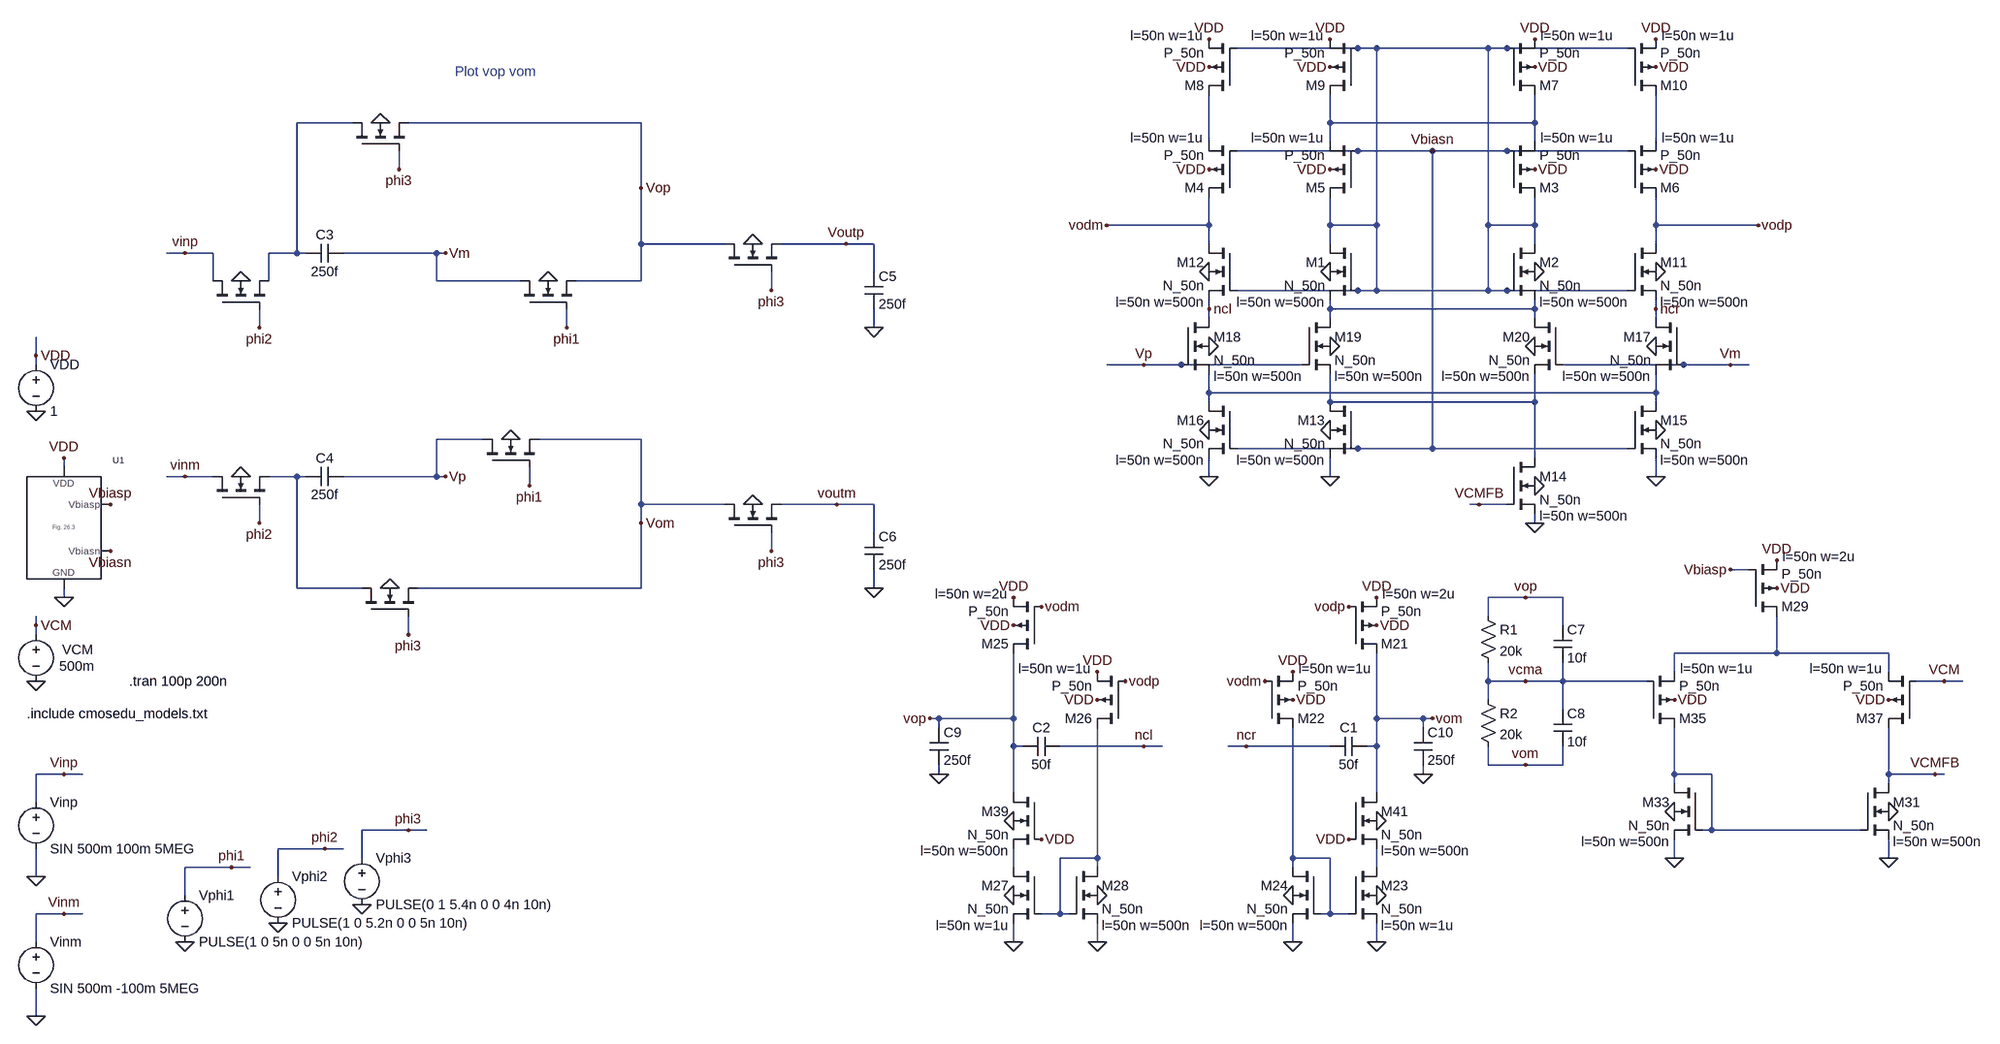
[diagram p0: schematic Fig26_36.asc]
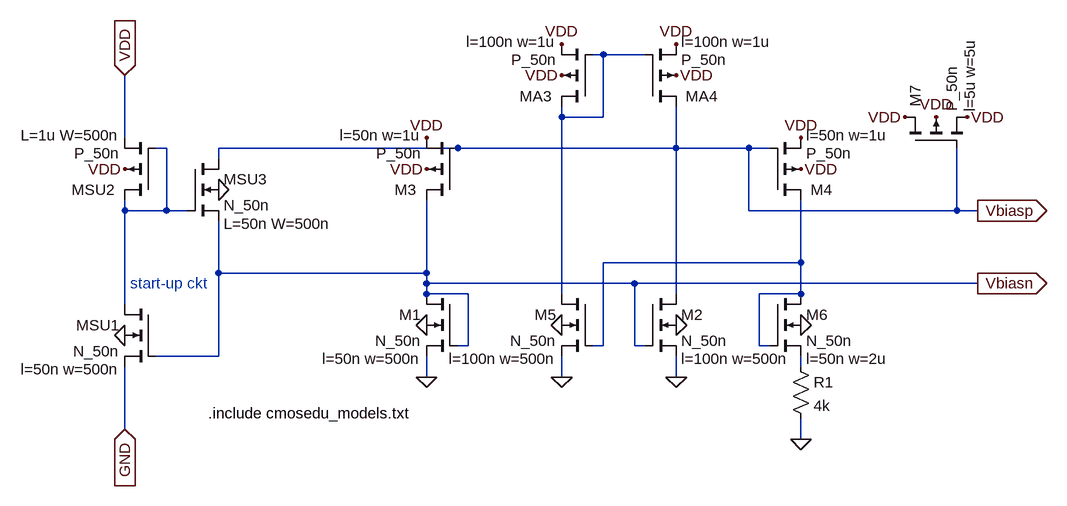
[diagram p1: sub-circuit fig_26_3.asc]
Fig26_36.asc, the LTspice schematic file:
Version 4
SHEET 1 4388 992
WIRE 3024 -896 2816 -896
WIRE 3056 -896 3024 -896
WIRE 3248 -896 3056 -896
WIRE 3280 -896 3248 -896
WIRE 3488 -896 3280 -896
WIRE 1296 -768 1200 -768
WIRE 1792 -768 1392 -768
WIRE 2976 -768 2976 -816
WIRE 3328 -768 3328 -816
WIRE 3328 -768 2976 -768
WIRE 2768 -736 2768 -816
WIRE 2976 -736 2976 -768
WIRE 3328 -736 3328 -768
WIRE 3536 -736 3536 -816
WIRE 3024 -720 2816 -720
WIRE 3152 -720 3024 -720
WIRE 3280 -720 3152 -720
WIRE 3488 -720 3280 -720
WIRE 1376 -688 1376 -720
WIRE 1792 -656 1792 -768
WIRE 2768 -592 2768 -640
WIRE 2768 -592 2592 -592
WIRE 2976 -592 2976 -640
WIRE 3056 -592 3056 -896
WIRE 3056 -592 2976 -592
WIRE 3248 -592 3248 -896
WIRE 3328 -592 3328 -640
WIRE 3328 -592 3248 -592
WIRE 3536 -592 3536 -640
WIRE 3712 -592 3536 -592
WIRE 1792 -560 1792 -656
WIRE 1936 -560 1792 -560
WIRE 2144 -560 2032 -560
WIRE 2192 -560 2144 -560
WIRE 2768 -560 2768 -592
WIRE 2976 -560 2976 -592
WIRE 3328 -560 3328 -592
WIRE 3536 -560 3536 -592
WIRE 1008 -544 976 -544
WIRE 1056 -544 1008 -544
WIRE 1200 -544 1200 -768
WIRE 1200 -544 1152 -544
WIRE 1216 -544 1200 -544
WIRE 1440 -544 1280 -544
WIRE 1456 -544 1440 -544
WIRE 2192 -512 2192 -560
WIRE 1056 -496 1056 -544
WIRE 1152 -496 1152 -544
WIRE 1440 -496 1440 -544
WIRE 1584 -496 1440 -496
WIRE 1792 -496 1792 -560
WIRE 1792 -496 1680 -496
WIRE 2016 -480 2016 -512
WIRE 3024 -480 2816 -480
WIRE 3056 -480 3056 -592
WIRE 3056 -480 3024 -480
WIRE 3248 -480 3248 -592
WIRE 3248 -480 3056 -480
WIRE 3280 -480 3248 -480
WIRE 3488 -480 3280 -480
WIRE 2768 -448 2768 -464
WIRE 2976 -448 2976 -464
WIRE 3328 -448 3328 -464
WIRE 3328 -448 2976 -448
WIRE 3536 -448 3536 -464
WIRE 2768 -432 2768 -448
WIRE 2976 -432 2976 -448
WIRE 3328 -432 3328 -448
WIRE 3536 -432 3536 -448
WIRE 1136 -416 1136 -448
WIRE 1664 -416 1664 -448
WIRE 2192 -416 2192 -448
WIRE 752 -368 752 -400
WIRE 752 -352 752 -368
WIRE 2656 -352 2592 -352
WIRE 2720 -352 2656 -352
WIRE 2928 -352 2720 -352
WIRE 3584 -352 3376 -352
WIRE 3664 -352 3584 -352
WIRE 3696 -352 3664 -352
WIRE 2768 -304 2768 -336
WIRE 3536 -304 3536 -336
WIRE 3536 -304 2768 -304
WIRE 2768 -288 2768 -304
WIRE 2976 -288 2976 -336
WIRE 3328 -288 3328 -336
WIRE 3328 -288 2976 -288
WIRE 3536 -288 3536 -304
WIRE 1520 -224 1440 -224
WIRE 1792 -224 1616 -224
WIRE 3024 -208 2816 -208
WIRE 3152 -208 3152 -720
WIRE 3152 -208 3024 -208
WIRE 3488 -208 3152 -208
WIRE 3328 -192 3328 -288
WIRE 800 -176 800 -192
WIRE 1008 -160 976 -160
WIRE 1056 -160 1008 -160
WIRE 1200 -160 1152 -160
WIRE 1216 -160 1200 -160
WIRE 1440 -160 1440 -224
WIRE 1440 -160 1280 -160
WIRE 1456 -160 1440 -160
WIRE 2768 -160 2768 -192
WIRE 2976 -160 2976 -192
WIRE 3536 -160 3536 -192
WIRE 1600 -144 1600 -176
WIRE 1792 -112 1792 -224
WIRE 1936 -112 1792 -112
WIRE 2128 -112 2032 -112
WIRE 2192 -112 2128 -112
WIRE 3232 -112 3216 -112
WIRE 3280 -112 3232 -112
WIRE 1136 -80 1136 -112
WIRE 1792 -80 1792 -112
WIRE 3328 -80 3328 -96
WIRE 2192 -64 2192 -112
WIRE 2016 -32 2016 -64
WIRE 3696 0 3664 0
WIRE 1200 32 1200 -160
WIRE 1312 32 1200 32
WIRE 1792 32 1792 -80
WIRE 1792 32 1408 32
WIRE 2192 32 2192 0
WIRE 800 48 800 32
WIRE 3312 48 3248 48
WIRE 3376 48 3312 48
WIRE 3248 80 3248 48
WIRE 752 96 752 80
WIRE 3376 96 3376 48
WIRE 752 112 752 96
WIRE 1392 112 1392 80
WIRE 3744 144 3744 80
WIRE 3744 144 3568 144
WIRE 3936 144 3744 144
WIRE 3568 176 3568 144
WIRE 3936 176 3936 144
WIRE 3248 192 3248 160
WIRE 3312 192 3248 192
WIRE 3376 192 3376 160
WIRE 3376 192 3312 192
WIRE 3520 192 3376 192
WIRE 4032 192 3984 192
WIRE 4064 192 4032 192
WIRE 3248 224 3248 192
WIRE 3376 240 3376 192
WIRE 2304 256 2288 256
WIRE 2432 256 2432 144
WIRE 2432 256 2304 256
WIRE 3056 256 3056 144
WIRE 3136 256 3056 256
WIRE 3152 256 3136 256
WIRE 2304 272 2304 256
WIRE 3136 272 3136 256
WIRE 2432 304 2432 256
WIRE 2448 304 2432 304
WIRE 2656 304 2512 304
WIRE 2688 304 2656 304
WIRE 2832 304 2800 304
WIRE 2976 304 2832 304
WIRE 3056 304 3056 256
WIRE 3056 304 3040 304
WIRE 3248 336 3248 304
WIRE 3312 336 3248 336
WIRE 3376 336 3376 304
WIRE 3376 336 3312 336
WIRE 800 352 752 352
WIRE 832 352 800 352
WIRE 2304 352 2304 336
WIRE 3136 352 3136 336
WIRE 3568 352 3568 272
WIRE 3632 352 3568 352
WIRE 3936 352 3936 272
WIRE 4016 352 3936 352
WIRE 4032 352 4016 352
WIRE 3568 368 3568 352
WIRE 3936 368 3936 352
WIRE 2432 384 2432 304
WIRE 3056 384 3056 304
WIRE 752 400 752 352
WIRE 1392 448 1312 448
WIRE 1424 448 1392 448
WIRE 3632 448 3632 352
WIRE 3632 448 3616 448
WIRE 3888 448 3632 448
WIRE 1248 480 1168 480
WIRE 1280 480 1248 480
WIRE 1312 496 1312 448
WIRE 2576 496 2576 272
WIRE 2576 496 2512 496
WIRE 2912 496 2912 272
WIRE 2976 496 2912 496
WIRE 3568 496 3568 464
WIRE 3936 496 3936 464
WIRE 1088 512 1008 512
WIRE 1120 512 1088 512
WIRE 2432 512 2432 480
WIRE 2576 512 2576 496
WIRE 2912 512 2912 496
WIRE 3056 512 3056 480
WIRE 752 528 752 480
WIRE 1168 528 1168 480
WIRE 1008 560 1008 512
WIRE 800 592 752 592
WIRE 832 592 800 592
WIRE 2512 592 2512 496
WIRE 2512 592 2480 592
WIRE 2528 592 2512 592
WIRE 2976 592 2976 496
WIRE 2976 592 2960 592
WIRE 3008 592 2976 592
WIRE 752 640 752 592
WIRE 2432 640 2432 608
WIRE 2576 640 2576 608
WIRE 2912 640 2912 608
WIRE 3056 640 3056 608
WIRE 752 768 752 720
FLAG 752 -272 0
FLAG 752 -368 VDD
FLAG 800 -192 VDD
FLAG 800 48 0
FLAG 752 192 0
FLAG 880 -32 Vbiasn
FLAG 880 -112 Vbiasp
FLAG 752 96 VCM
FLAG 752 528 0
FLAG 800 352 Vinp
FLAG 752 768 0
FLAG 800 592 Vinm
FLAG 1104 -496 0
FLAG 1136 -416 phi2
FLAG 1008 -544 vinp
FLAG 1104 -160 0
FLAG 1136 -80 phi2
FLAG 1008 -160 vinm
FLAG 1456 -544 Vm
FLAG 1456 -160 Vp
FLAG 1344 -768 0
FLAG 1376 -688 phi3
FLAG 1360 32 0
FLAG 1392 112 phi3
FLAG 1632 -496 0
FLAG 1664 -416 phi1
FLAG 1568 -224 0
FLAG 1600 -144 phi1
FLAG 1792 -656 Vop
FLAG 1792 -80 Vom
FLAG 1984 -560 0
FLAG 2016 -480 phi3
FLAG 1984 -112 0
FLAG 2016 -32 phi3
FLAG 2192 -416 0
FLAG 2192 32 0
FLAG 2144 -560 Voutp
FLAG 2128 -112 voutm
FLAG 1008 640 0
FLAG 1088 512 phi1
FLAG 1168 608 0
FLAG 1248 480 phi2
FLAG 1312 576 0
FLAG 1392 448 phi3
FLAG 2976 -512 0
FLAG 3328 -512 0
FLAG 3328 -688 VDD
FLAG 2768 -688 VDD
FLAG 2976 -688 VDD
FLAG 3536 -688 VDD
FLAG 3328 -912 VDD
FLAG 3328 -864 VDD
FLAG 2768 -864 VDD
FLAG 2768 -912 VDD
FLAG 2976 -864 VDD
FLAG 2976 -912 VDD
FLAG 3536 -912 VDD
FLAG 3536 -864 VDD
FLAG 3536 -512 0
FLAG 2768 -512 0
FLAG 2976 -240 0
FLAG 3328 -144 0
FLAG 3536 -240 0
FLAG 2768 -240 0
FLAG 3536 -384 0
FLAG 2768 -384 0
FLAG 2976 -384 0
FLAG 3328 -384 0
FLAG 2768 -160 0
FLAG 3152 -720 Vbiasn
FLAG 3712 -592 vodp
FLAG 2592 -592 vodm
FLAG 2656 -352 Vp
FLAG 3664 -352 Vm
FLAG 3536 -448 ncr
FLAG 2768 -448 ncl
FLAG 3056 48 VDD
FLAG 3056 96 VDD
FLAG 2912 176 VDD
FLAG 2912 224 VDD
FLAG 3056 560 0
FLAG 3056 640 0
FLAG 2912 560 0
FLAG 2912 640 0
FLAG 2832 304 ncr
FLAG 3008 64 vodp
FLAG 2864 192 vodm
FLAG 2432 48 VDD
FLAG 2432 96 VDD
FLAG 2576 176 VDD
FLAG 2576 224 VDD
FLAG 2432 560 0
FLAG 2432 640 0
FLAG 2576 560 0
FLAG 2576 640 0
FLAG 2656 304 ncl
FLAG 2480 64 vodm
FLAG 2624 192 vodp
FLAG 2976 -160 0
FLAG 3536 -160 0
FLAG 3328 -80 0
FLAG 3232 -112 VCMFB
FLAG 3312 48 vop
FLAG 3312 336 vom
FLAG 3312 192 vcma
FLAG 3936 496 0
FLAG 3744 -16 VDD
FLAG 3744 32 VDD
FLAG 3936 416 0
FLAG 3568 496 0
FLAG 3568 416 0
FLAG 3664 0 Vbiasp
FLAG 3568 224 VDD
FLAG 3936 224 VDD
FLAG 4032 192 VCM
FLAG 2432 432 0
FLAG 2480 464 VDD
FLAG 3056 432 0
FLAG 3008 464 VDD
FLAG 2288 256 vop
FLAG 2304 352 0
FLAG 3152 256 vom
FLAG 3136 352 0
FLAG 4016 352 VCMFB
SYMBOL voltage 752 -368 R0
WINDOW 123 0 0 Left 2
WINDOW 39 0 0 Left 2
SYMATTR InstName VDD
SYMATTR Value 1
SYMBOL voltage 752 96 R0
WINDOW 0 45 42 Left 2
WINDOW 3 40 70 Left 2
WINDOW 123 0 0 Left 2
WINDOW 39 0 0 Left 2
SYMATTR InstName VCM
SYMATTR Value 500m
SYMBOL Fig_26_3 736 -64 R0
SYMATTR InstName U1
SYMBOL voltage 752 384 R0
SYMATTR InstName Vinp
SYMATTR Value SIN 500m 100m 5MEG
SYMBOL voltage 752 624 R0
SYMATTR InstName Vinm
SYMATTR Value SIN 500m -100m 5MEG
SYMBOL nmos4 1056 -448 R270
WINDOW 0 56 32 Invisible 2
WINDOW 3 56 72 Invisible 2
SYMATTR InstName M30
SYMATTR Value N_50n
SYMATTR Value2 l=50n w=500n
SYMBOL cap 1216 -560 M90
WINDOW 0 0 32 VBottom 2
WINDOW 3 32 32 VTop 2
SYMATTR InstName C3
SYMATTR Value 250f
SYMBOL nmos4 1056 -112 R270
WINDOW 0 56 32 Invisible 2
WINDOW 3 56 72 Invisible 2
SYMATTR InstName M32
SYMATTR Value N_50n
SYMATTR Value2 l=50n w=500n
SYMBOL cap 1216 -176 M90
WINDOW 0 0 32 VBottom 2
WINDOW 3 32 32 VTop 2
SYMATTR InstName C4
SYMATTR Value 250f
SYMBOL nmos4 1296 -720 R270
WINDOW 0 56 32 Invisible 2
WINDOW 3 56 72 Invisible 2
SYMATTR InstName M34
SYMATTR Value N_50n
SYMATTR Value2 l=50n w=500n
SYMBOL nmos4 1312 80 R270
WINDOW 0 56 32 Invisible 2
WINDOW 3 56 72 Invisible 2
SYMATTR InstName M36
SYMATTR Value N_50n
SYMATTR Value2 l=50n w=500n
SYMBOL nmos4 1584 -448 R270
WINDOW 0 56 32 Invisible 2
WINDOW 3 56 72 Invisible 2
SYMATTR InstName M38
SYMATTR Value N_50n
SYMATTR Value2 l=50n w=500n
SYMBOL nmos4 1520 -176 R270
WINDOW 0 56 32 Invisible 2
WINDOW 3 56 72 Invisible 2
SYMATTR InstName M40
SYMATTR Value N_50n
SYMATTR Value2 l=50n w=500n
SYMBOL nmos4 1936 -512 R270
WINDOW 0 56 32 Invisible 2
WINDOW 3 56 72 Invisible 2
SYMATTR InstName M42
SYMATTR Value N_50n
SYMATTR Value2 l=50n w=500n
SYMBOL nmos4 1936 -64 R270
WINDOW 0 56 32 Invisible 2
WINDOW 3 56 72 Invisible 2
SYMATTR InstName M44
SYMATTR Value N_50n
SYMATTR Value2 l=50n w=500n
SYMBOL cap 2176 -512 R0
SYMATTR InstName C5
SYMATTR Value 250f
SYMBOL cap 2176 -64 R0
SYMATTR InstName C6
SYMATTR Value 250f
SYMBOL voltage 1008 544 R0
WINDOW 123 0 0 Left 2
WINDOW 39 0 0 Left 2
SYMATTR InstName Vphi1
SYMATTR Value PULSE(1 0 5n 0 0 5n 10n)
SYMBOL voltage 1168 512 R0
WINDOW 123 0 0 Left 2
WINDOW 39 0 0 Left 2
SYMATTR InstName Vphi2
SYMATTR Value PULSE(1 0 5.2n 0 0 5n 10n)
SYMBOL voltage 1312 480 R0
WINDOW 123 0 0 Left 2
WINDOW 39 0 0 Left 2
SYMATTR InstName Vphi3
SYMATTR Value PULSE(0 1 5.4n 0 0 4n 10n)
SYMBOL nmos4 3024 -560 M0
WINDOW 123 56 100 Left 2
SYMATTR Value2 l=50n w=500n
SYMATTR InstName M1
SYMATTR Value N_50n
SYMBOL nmos4 3280 -560 R0
WINDOW 123 56 100 Left 2
SYMATTR Value2 l=50n w=500n
SYMATTR InstName M2
SYMATTR Value N_50n
SYMBOL pmos4 3280 -640 M180
WINDOW 123 58 102 Left 2
WINDOW 0 56 16 Left 2
SYMATTR Value2 l=50n w=1u
SYMATTR InstName M3
SYMATTR Value P_50n
SYMBOL pmos4 2816 -640 R180
WINDOW 123 58 102 Left 2
WINDOW 0 56 16 Left 2
SYMATTR Value2 l=50n w=1u
SYMATTR InstName M4
SYMATTR Value P_50n
SYMBOL pmos4 3024 -640 R180
WINDOW 123 58 102 Left 2
WINDOW 0 56 16 Left 2
SYMATTR Value2 l=50n w=1u
SYMATTR InstName M5
SYMATTR Value P_50n
SYMBOL pmos4 3488 -640 M180
WINDOW 123 58 102 Left 2
WINDOW 0 56 16 Left 2
SYMATTR Value2 l=50n w=1u
SYMATTR InstName M6
SYMATTR Value P_50n
SYMBOL pmos4 3280 -816 M180
WINDOW 123 58 102 Left 2
WINDOW 0 56 16 Left 2
SYMATTR Value2 l=50n w=1u
SYMATTR InstName M7
SYMATTR Value P_50n
SYMBOL pmos4 2816 -816 R180
WINDOW 123 58 102 Left 2
WINDOW 0 56 16 Left 2
SYMATTR Value2 l=50n w=1u
SYMATTR InstName M8
SYMATTR Value P_50n
SYMBOL pmos4 3024 -816 R180
WINDOW 123 58 102 Left 2
WINDOW 0 56 16 Left 2
SYMATTR Value2 l=50n w=1u
SYMATTR InstName M9
SYMATTR Value P_50n
SYMBOL pmos4 3488 -816 M180
WINDOW 123 58 102 Left 2
WINDOW 0 56 16 Left 2
SYMATTR Value2 l=50n w=1u
SYMATTR InstName M10
SYMATTR Value P_50n
SYMBOL nmos4 3488 -560 R0
WINDOW 123 56 100 Left 2
SYMATTR Value2 l=50n w=500n
SYMATTR InstName M11
SYMATTR Value N_50n
SYMBOL nmos4 2816 -560 M0
WINDOW 123 56 100 Left 2
SYMATTR Value2 l=50n w=500n
SYMATTR InstName M12
SYMATTR Value N_50n
SYMBOL nmos4 3024 -288 M0
WINDOW 123 56 100 Left 2
SYMATTR Value2 l=50n w=500n
SYMATTR InstName M13
SYMATTR Value N_50n
SYMBOL nmos4 3280 -192 R0
WINDOW 123 56 100 Left 2
SYMATTR Value2 l=50n w=500n
SYMATTR InstName M14
SYMATTR Value N_50n
SYMBOL nmos4 3488 -288 R0
WINDOW 123 56 100 Left 2
SYMATTR Value2 l=50n w=500n
SYMATTR InstName M15
SYMATTR Value N_50n
SYMBOL nmos4 2816 -288 M0
WINDOW 123 56 100 Left 2
SYMATTR Value2 l=50n w=500n
SYMATTR InstName M16
SYMATTR Value N_50n
SYMBOL nmos4 3584 -432 M0
WINDOW 123 56 100 Left 2
SYMATTR Value2 l=50n w=500n
SYMATTR InstName M17
SYMATTR Value N_50n
SYMBOL nmos4 2720 -432 R0
WINDOW 123 56 100 Left 2
SYMATTR Value2 l=50n w=500n
SYMATTR InstName M18
SYMATTR Value N_50n
SYMBOL nmos4 2928 -432 R0
WINDOW 123 56 100 Left 2
SYMATTR Value2 l=50n w=500n
SYMATTR InstName M19
SYMATTR Value N_50n
SYMBOL nmos4 3376 -432 M0
WINDOW 123 56 100 Left 2
SYMATTR Value2 l=50n w=500n
SYMATTR InstName M20
SYMATTR Value N_50n
SYMBOL pmos4 3008 144 M180
WINDOW 123 58 102 Left 2
WINDOW 0 56 16 Left 2
SYMATTR Value2 l=50n w=2u
SYMATTR InstName M21
SYMATTR Value P_50n
SYMBOL pmos4 2864 272 M180
WINDOW 123 58 102 Left 2
WINDOW 0 56 16 Left 2
SYMATTR Value2 l=50n w=1u
SYMATTR InstName M22
SYMATTR Value P_50n
SYMBOL nmos4 3008 512 R0
WINDOW 123 56 100 Left 2
SYMATTR Value2 l=50n w=1u
SYMATTR InstName M23
SYMATTR Value N_50n
SYMBOL nmos4 2960 512 M0
WINDOW 123 56 100 Left 2
SYMATTR Value2 l=50n w=500n
SYMATTR InstName M24
SYMATTR Value N_50n
SYMBOL cap 3040 288 R90
WINDOW 0 0 32 VBottom 2
WINDOW 3 32 32 VTop 2
SYMATTR InstName C1
SYMATTR Value 50f
SYMBOL pmos4 2480 144 R180
WINDOW 123 58 102 Left 2
WINDOW 0 56 16 Left 2
SYMATTR Value2 l=50n w=2u
SYMATTR InstName M25
SYMATTR Value P_50n
SYMBOL pmos4 2624 272 R180
WINDOW 123 58 102 Left 2
WINDOW 0 56 16 Left 2
SYMATTR Value2 l=50n w=1u
SYMATTR InstName M26
SYMATTR Value P_50n
SYMBOL nmos4 2480 512 M0
WINDOW 123 56 100 Left 2
SYMATTR Value2 l=50n w=1u
SYMATTR InstName M27
SYMATTR Value N_50n
SYMBOL nmos4 2528 512 R0
WINDOW 123 56 100 Left 2
SYMATTR Value2 l=50n w=500n
SYMATTR InstName M28
SYMATTR Value N_50n
SYMBOL cap 2448 288 M90
WINDOW 0 0 32 VBottom 2
WINDOW 3 32 32 VTop 2
SYMATTR InstName C2
SYMATTR Value 50f
SYMBOL res 3232 64 R0
SYMATTR InstName R1
SYMATTR Value 20k
SYMBOL res 3232 208 R0
SYMATTR InstName R2
SYMATTR Value 20k
SYMBOL cap 3360 96 R0
SYMATTR InstName C7
SYMATTR Value 10f
SYMBOL cap 3360 240 R0
SYMATTR InstName C8
SYMATTR Value 10f
SYMBOL pmos4 3696 80 M180
WINDOW 123 58 102 Left 2
WINDOW 0 56 16 Left 2
SYMATTR Value2 l=50n w=2u
SYMATTR InstName M29
SYMATTR Value P_50n
SYMBOL nmos4 3888 368 R0
WINDOW 123 56 100 Left 2
SYMATTR Value2 l=50n w=500n
SYMATTR InstName M31
SYMATTR Value N_50n
SYMBOL nmos4 3616 368 M0
WINDOW 123 56 100 Left 2
SYMATTR Value2 l=50n w=500n
SYMATTR InstName M33
SYMATTR Value N_50n
SYMBOL pmos4 3520 272 M180
WINDOW 123 58 102 Left 2
WINDOW 0 56 16 Left 2
SYMATTR Value2 l=50n w=1u
SYMATTR InstName M35
SYMATTR Value P_50n
SYMBOL pmos4 3984 272 R180
WINDOW 123 58 102 Left 2
WINDOW 0 56 16 Left 2
SYMATTR Value2 l=50n w=1u
SYMATTR InstName M37
SYMATTR Value P_50n
SYMBOL nmos4 2480 384 M0
WINDOW 123 56 100 Left 2
SYMATTR Value2 l=50n w=500n
SYMATTR InstName M39
SYMATTR Value N_50n
SYMBOL nmos4 3008 384 R0
WINDOW 123 56 100 Left 2
SYMATTR Value2 l=50n w=500n
SYMATTR InstName M41
SYMATTR Value N_50n
SYMBOL cap 2288 272 R0
SYMATTR InstName C9
SYMATTR Value 250f
SYMBOL cap 3120 272 R0
SYMATTR InstName C10
SYMATTR Value 250f
TEXT 736 248 Left 2 !.include cmosedu_models.txt
TEXT 912 192 Left 2 !.tran 100p 200n
TEXT 1472 -856 Left 2 ;Plot vop vom

fig_26_3.asc, the sub-circuit schematic file:
Version 4
SHEET 1 2004 680
WIRE 1280 -304 1264 -304
WIRE 1344 -304 1280 -304
WIRE 1216 -208 1216 -224
WIRE 1280 -208 1280 -304
WIRE 1280 -208 1216 -208
WIRE 544 -176 544 -272
WIRE 608 -160 592 -160
WIRE 1056 -160 688 -160
WIRE 1392 -160 1392 -224
WIRE 1392 -160 1056 -160
WIRE 1504 -160 1392 -160
WIRE 1536 -160 1504 -160
WIRE 688 -144 688 -160
WIRE 544 -64 544 -80
WIRE 608 -64 608 -160
WIRE 608 -64 544 -64
WIRE 640 -64 608 -64
WIRE 1504 -64 1504 -160
WIRE 1824 -64 1824 -160
WIRE 1824 -64 1504 -64
WIRE 1856 -64 1824 -64
WIRE 1584 16 1584 -80
WIRE 1584 16 1280 16
WIRE 688 32 688 -48
WIRE 1008 32 1008 -80
WIRE 1008 32 688 32
WIRE 1008 48 1008 32
WIRE 1328 48 1008 48
WIRE 1856 48 1328 48
WIRE 1008 64 1008 48
WIRE 1072 64 1008 64
WIRE 1216 64 1216 -208
WIRE 1392 64 1392 -160
WIRE 1584 64 1584 16
WIRE 1584 64 1520 64
WIRE 544 80 544 -64
WIRE 1072 144 1072 64
WIRE 1072 144 1056 144
WIRE 1280 144 1280 16
WIRE 1280 144 1264 144
WIRE 1328 144 1328 48
WIRE 1344 144 1328 144
WIRE 1520 144 1520 64
WIRE 1536 144 1520 144
WIRE 688 160 688 32
WIRE 688 160 592 160
WIRE 1584 176 1584 160
WIRE 1008 192 1008 160
WIRE 1216 192 1216 160
WIRE 1392 192 1392 160
WIRE 544 272 544 176
WIRE 1584 288 1584 256
FLAG 544 -128 VDD
FLAG 1008 -128 VDD
FLAG 1008 -176 VDD
FLAG 1584 -128 VDD
FLAG 1584 -176 VDD
FLAG 1584 288 0
FLAG 1584 112 0
FLAG 1392 -272 VDD
FLAG 1392 -320 VDD
FLAG 1216 -272 VDD
FLAG 1216 -320 VDD
FLAG 1392 112 0
FLAG 1792 -208 VDD
FLAG 1744 -208 VDD
FLAG 1840 -208 VDD
FLAG 544 -272 VDD
IOPIN 544 -272 In
FLAG 544 272 GND
IOPIN 544 272 In
FLAG 688 -96 0
FLAG 544 128 0
FLAG 1008 192 0
FLAG 1008 112 0
FLAG 1216 112 0
FLAG 1216 192 0
FLAG 1392 192 0
FLAG 1856 -64 Vbiasp
IOPIN 1856 -64 Out
FLAG 1856 48 Vbiasn
IOPIN 1856 48 Out
SYMBOL pmos4 592 -80 R180
WINDOW 0 63 16 Left 2
WINDOW 123 56 100 Left 2
SYMATTR InstName MSU2
SYMATTR Value2 L=1u W=500n
SYMATTR Value P_50n
SYMBOL nmos4 592 80 M0
WINDOW 123 56 100 Left 2
SYMATTR Value2 l=50n w=500n
SYMATTR InstName MSU1
SYMATTR Value N_50n
SYMBOL nmos4 640 -144 R0
WINDOW 123 56 100 Left 2
SYMATTR Value2 L=50n W=500n
SYMATTR InstName MSU3
SYMATTR Value N_50n
SYMBOL pmos4 1056 -80 R180
WINDOW 0 63 16 Left 2
WINDOW 123 56 100 Left 2
SYMATTR InstName M3
SYMATTR Value2 l=50n w=1u
SYMATTR Value P_50n
SYMBOL pmos4 1536 -80 M180
WINDOW 0 63 16 Left 2
WINDOW 123 56 100 Left 2
SYMATTR InstName M4
SYMATTR Value2 l=50n w=1u
SYMATTR Value P_50n
SYMBOL nmos4 1056 64 M0
WINDOW 123 56 100 Left 2
SYMATTR Value2 l=50n w=500n
SYMATTR InstName M1
SYMATTR Value N_50n
SYMBOL res 1568 160 R0
SYMATTR InstName R1
SYMATTR Value 4k
SYMBOL pmos4 1344 -224 M180
WINDOW 0 63 16 Left 2
WINDOW 123 56 100 Left 2
SYMATTR InstName MA4
SYMATTR Value2 l=100n w=1u
SYMATTR Value P_50n
SYMBOL pmos4 1264 -224 R180
WINDOW 0 63 16 Left 2
WINDOW 123 56 100 Left 2
SYMATTR InstName MA3
SYMATTR Value2 l=100n w=1u
SYMATTR Value P_50n
SYMBOL nmos4 1264 64 M0
WINDOW 123 56 100 Left 2
SYMATTR Value2 l=100n w=500n
SYMATTR InstName M5
SYMATTR Value N_50n
SYMBOL pmos4 1744 -160 R270
WINDOW 0 63 16 Left 2
WINDOW 123 56 100 Left 2
SYMATTR InstName M7
SYMATTR Value2 l=5u w=5u
SYMATTR Value P_50n
SYMBOL nmos4 1344 64 R0
WINDOW 123 56 100 Left 2
SYMATTR Value2 l=100n w=500n
SYMATTR InstName M2
SYMATTR Value N_50n
SYMBOL nmos4 1536 64 R0
WINDOW 123 56 100 Left 2
SYMATTR Value2 l=50n w=2u
SYMATTR InstName M6
SYMATTR Value N_50n
TEXT 552 48 Left 2 ;start-up ckt
TEXT 672 248 Left 2 !.include cmosedu_models.txt

The netlist it stands for:
* Fig26_36.asc
VDD VDD 0 1
VCM VCM 0 500m
XU1 Vbiasn Vbiasp VDD 0 fig_26_3
Vinp Vinp 0 SIN 500m 100m 5MEG
Vinm Vinm 0 SIN 500m -100m 5MEG
M30 Vinp phi2 N002 0 N_50n l=50n w=500n
C3 N002 Vm 250f
M32 Vinm phi2 N009 0 N_50n l=50n w=500n
C4 N009 Vp 250f
M34 N002 phi3 Vop 0 N_50n l=50n w=500n
M36 N009 phi3 Vom 0 N_50n l=50n w=500n
M38 Vm phi1 Vop 0 N_50n l=50n w=500n
M40 Vp phi1 Vom 0 N_50n l=50n w=500n
M42 Vop phi3 Voutp 0 N_50n l=50n w=500n
M44 Vom phi3 voutm 0 N_50n l=50n w=500n
C5 Voutp 0 250f
C6 voutm 0 250f
Vphi1 phi1 0 PULSE(1 0 5n 0 0 5n 10n)
Vphi2 phi2 0 PULSE(1 0 5.2n 0 0 5n 10n)
Vphi3 phi3 0 PULSE(0 1 5.4n 0 0 4n 10n)
M1 N001 N001 N006 0 N_50n l=50n w=500n
M2 N001 N001 N006 0 N_50n l=50n w=500n
M3 N001 Vbiasn N003 VDD P_50n l=50n w=1u
M4 vodm Vbiasn N004 VDD P_50n l=50n w=1u
M5 N001 Vbiasn N003 VDD P_50n l=50n w=1u
M6 vodp Vbiasn N005 VDD P_50n l=50n w=1u
M7 N003 N001 VDD VDD P_50n l=50n w=1u
M8 N004 N001 VDD VDD P_50n l=50n w=1u
M9 N003 N001 VDD VDD P_50n l=50n w=1u
M10 N005 N001 VDD VDD P_50n l=50n w=1u
M11 vodp N001 ncr 0 N_50n l=50n w=500n
M12 vodm N001 ncl 0 N_50n l=50n w=500n
M13 N008 Vbiasn 0 0 N_50n l=50n w=500n
M14 N008 VCMFB 0 0 N_50n l=50n w=500n
M15 N007 Vbiasn 0 0 N_50n l=50n w=500n
M16 N007 Vbiasn 0 0 N_50n l=50n w=500n
M17 ncr Vm N007 0 N_50n l=50n w=500n
M18 ncl Vp N007 0 N_50n l=50n w=500n
M19 N006 Vp N008 0 N_50n l=50n w=500n
M20 N006 Vm N008 0 N_50n l=50n w=500n
M21 Vom vodp VDD VDD P_50n l=50n w=2u
M22 N013 vodm VDD VDD P_50n l=50n w=1u
M23 N015 N013 0 0 N_50n l=50n w=1u
M24 N013 N013 0 0 N_50n l=50n w=500n
C1 Vom ncr 50f
M25 Vop vodm VDD VDD P_50n l=50n w=2u
M26 N012 vodp VDD VDD P_50n l=50n w=1u
M27 N014 N012 0 0 N_50n l=50n w=1u
M28 N012 N012 0 0 N_50n l=50n w=500n
C2 Vop ncl 50f
R1 Vop vcma 20k
R2 vcma Vom 20k
C7 Vop vcma 10f
C8 vcma Vom 10f
M29 N010 Vbiasp VDD VDD P_50n l=50n w=2u
M31 VCMFB N011 0 0 N_50n l=50n w=500n
M33 N011 N011 0 0 N_50n l=50n w=500n
M35 N011 vcma N010 VDD P_50n l=50n w=1u
M37 VCMFB VCM N010 VDD P_50n l=50n w=1u
M39 Vop VDD N014 0 N_50n l=50n w=500n
M41 Vom VDD N015 0 N_50n l=50n w=500n
C9 Vop 0 250f
C10 Vom 0 250f

* block symbol definitions
.subckt fig_26_3 Vbiasn Vbiasp VDD GND
MSU2 N002 N002 VDD VDD P_50n L=1u W=500n
MSU1 N002 Vbiasn GND 0 N_50n l=50n w=500n
MSU3 Vbiasp N002 Vbiasn 0 N_50n L=50n W=500n
M3 Vbiasn Vbiasp VDD VDD P_50n l=50n w=1u
M4 N003 Vbiasp VDD VDD P_50n l=50n w=1u
M1 Vbiasn Vbiasn 0 0 N_50n l=50n w=500n
R1 N004 0 4k
MA4 Vbiasp N001 VDD VDD P_50n l=100n w=1u
MA3 N001 N001 VDD VDD P_50n l=100n w=1u
M5 N001 N003 0 0 N_50n l=100n w=500n
M7 VDD Vbiasp VDD VDD P_50n l=5u w=5u
M2 Vbiasp Vbiasn 0 0 N_50n l=100n w=500n
M6 N003 N003 N004 0 N_50n l=50n w=2u
* start-up ckt
.include cmosedu_models.txt
.ends fig_26_3

.model NMOS NMOS
.model PMOS PMOS
.lib standard.mos
.include cmosedu_models.txt
.tran 100p 200n
* Plot vop vom
.backanno
.end